# EAGLE design 328pv3 (EAGLE 7.6.0)
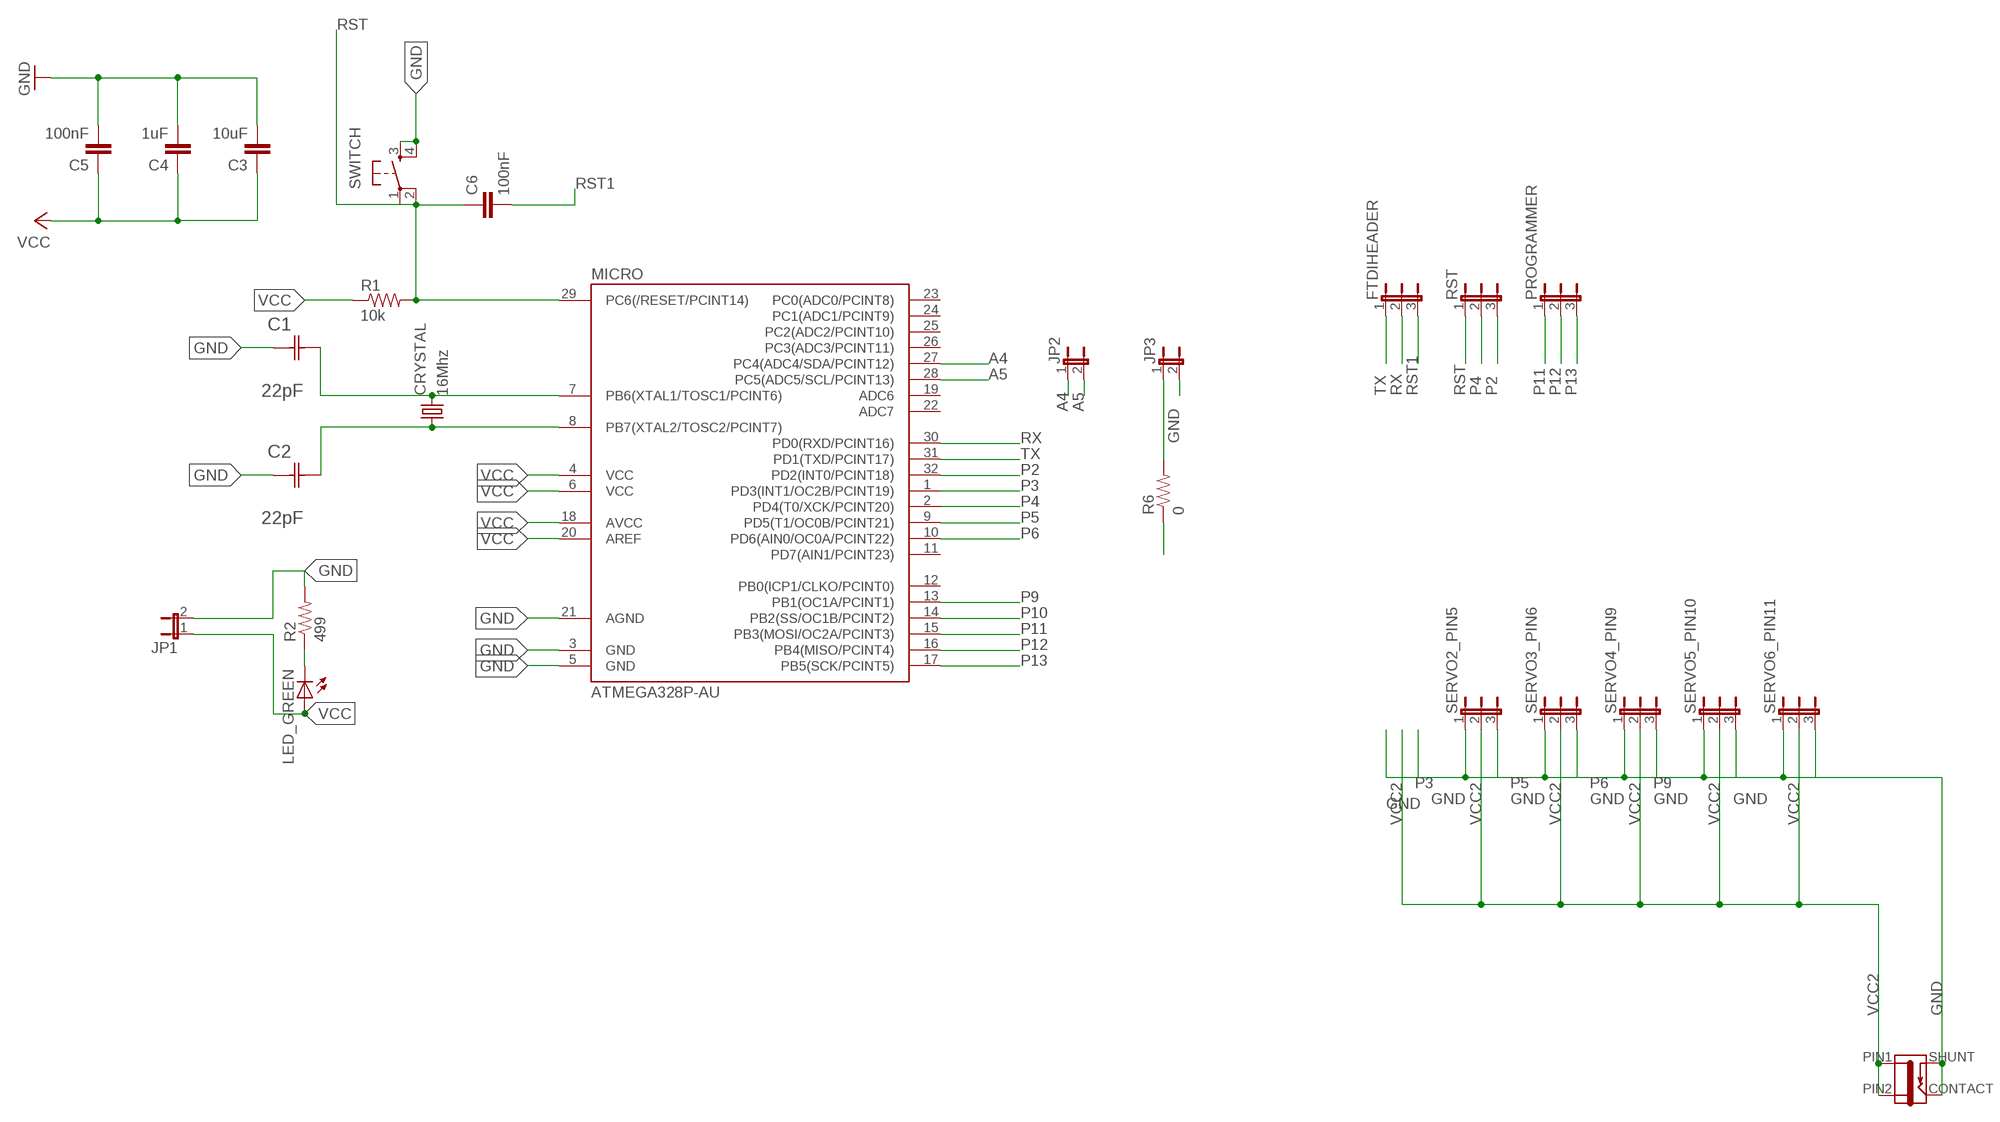
[diagram p0: schematic, sheet 1]

## Parts
C1  22pF  0612ZC225MAT2A  [CAPC3216X178N]
C2  22pF  0612ZC225MAT2A  [CAPC3216X178N]
C3  10uF  CAP1206  [1206]
C4  1uF  CAP1206  [1206]
C5  100nF  CAP1206  [1206]
C6  100nF  CAP1206  [1206]
CRYSTAL  16Mhz  CSM-7X-DU  [CSM-7X-DU]
FTDIHEADER  JP2E  [JP2]
J1  JACK-2.1MM  [PJ-002AH-SMT]
JP1  JP1E  [JP1]
JP2  JP1E  [JP1]
JP3  JP1E  [JP1]
LED_GREEN  LED1206  [1206]
MICRO  ATMEGA328P-AU  ATMEGA48/88/168-AU  [TQFP32-08]
PROGRAMMER  JP2E  [JP2]
R1  10k  RESISTOR1206  [1206]
R2  499  RESISTOR1206  [1206]
R6  0  RESISTOR1206  [1206]
RST  JP2E  [JP2]
SERVO2_PIN5  JP2E  [JP2]
SERVO3_PIN6  JP2E  [JP2]
SERVO4_PIN9  JP2E  [JP2]
SERVO5_PIN10  JP2E  [JP2]
SERVO6_PIN11  JP2E  [JP2]
SWITCH  6MM_SWITCH6MM_SWITCH  [6MM_SWITCH]

## Nets
A4: JP2.1 MICRO.27(PC4(ADC4/SDA/PCINT12))
A5: JP2.2 MICRO.28(PC5(ADC5/SCL/PCINT13))
GND: C1.1(C1) C2.1(C1) C3.2 C4.2 C5.2 J1.CONTACT J1.SHUNT JP1.2 JP3.2 MICRO.3(GND) MICRO.5(GND) MICRO.21(AGND) R2.2 SERVO2_PIN5.1 SERVO3_PIN6.1 SERVO4_PIN9.1 SERVO5_PIN10.1 SERVO6_PIN11.1 SWITCH.3(S) SWITCH.4(S1)
N$2: C1.2(C2) CRYSTAL.2 MICRO.7(PB6(XTAL1/TOSC1/PCINT6))
N$8: JP3.1 R6.2
N$9: C2.2(C2) CRYSTAL.1 MICRO.8(PB7(XTAL2/TOSC2/PCINT7))
N$26: LED_GREEN.2(C) R2.1
P2: MICRO.32(PD2(INT0/PCINT18)) RST.3
P3: MICRO.1(PD3(INT1/OC2B/PCINT19))
P4: MICRO.2(PD4(T0/XCK/PCINT20)) RST.2
P5: MICRO.9(PD5(T1/OC0B/PCINT21)) SERVO2_PIN5.3
P6: MICRO.10(PD6(AIN0/OC0A/PCINT22)) SERVO3_PIN6.3
P9: MICRO.13(PB1(OC1A/PCINT1)) SERVO4_PIN9.3
P10: MICRO.14(PB2(SS/OC1B/PCINT2)) SERVO5_PIN10.3
P11: MICRO.15(PB3(MOSI/OC2A/PCINT3)) PROGRAMMER.1 SERVO6_PIN11.3
P12: MICRO.16(PB4(MISO/PCINT4)) PROGRAMMER.2
P13: MICRO.17(PB5(SCK/PCINT5)) PROGRAMMER.3
RST: C6.1 MICRO.29(PC6(/RESET/PCINT14)) R1.2 RST.1 SWITCH.1(P) SWITCH.2(P1)
RST1: C6.2 FTDIHEADER.3
RX: FTDIHEADER.2 MICRO.30(PD0(RXD/PCINT16))
TX: FTDIHEADER.1 MICRO.31(PD1(TXD/PCINT17))
VCC: C3.1 C4.1 C5.1 JP1.1 LED_GREEN.1(A) MICRO.4(VCC) MICRO.6(VCC) MICRO.18(AVCC) MICRO.20(AREF) R1.1
VCC2: J1.PIN1 J1.PIN2 R6.1 SERVO2_PIN5.2 SERVO3_PIN6.2 SERVO4_PIN9.2 SERVO5_PIN10.2 SERVO6_PIN11.2
Unconnected: MICRO.11(PD7(AIN1/PCINT23)) MICRO.12(PB0(ICP1/CLKO/PCINT0)) MICRO.19(ADC6) MICRO.22(ADC7) MICRO.23(PC0(ADC0/PCINT8)) MICRO.24(PC1(ADC1/PCINT9)) MICRO.25(PC2(ADC2/PCINT10)) MICRO.26(PC3(ADC3/PCINT11))

## Library data of the parts
C1 C2 = AVX_By_element14_Batch_1:0612ZC225MAT2A: Capacitor 1206; MPN: 0612ZC225MAT2A; OC_FARNELL: -; OC_NEWARK: 12N3209; SUPPLIER: AVX; TOLERANCE: ±20%; VALUE: 2.2µF; VOLTAGERATING: 10V
C3-C6 = 01_SparkFun:CAP: Capacitor Standard 0603 ceramic capacitor, and 0.1" leaded capacitor.
CRYSTAL = 01_FAB_Hello:CSM-7X-DU: SMD CRYSTAL Source: www.ecsxtal.com .. Crystal 3.6864MHz CSM_7X_DU.PDF; OC_FARNELL: unknown; OC_NEWARK: unknown
FTDIHEADER PROGRAMMER RST SERVO2_PIN5 SERVO3_PIN6 SERVO4_PIN9 SERVO5_PIN10 SERVO6_PIN11 = jumper:JP2E: JUMPER
J1 = fab:JACK-2.1MM: SMD DC power jack PJ-002AH-SMT As found in the fablab inventory. Made by Zaerc.
JP1-JP3 = jumper:JP1E: JUMPER
LED_GREEN = 01_FAB_Hello:LED
MICRO = atmega8:ATMEGA48/88/168
R1 R2 R6 = 01_SparkFun:RESISTOR: Resistor Basic schematic elements and footprints for 0603, 1206, and PTH 1/10th watt (small) resistors.
SWITCH = 01_FAB_Hello:6MM_SWITCH: OMRON SWITCH

## Board
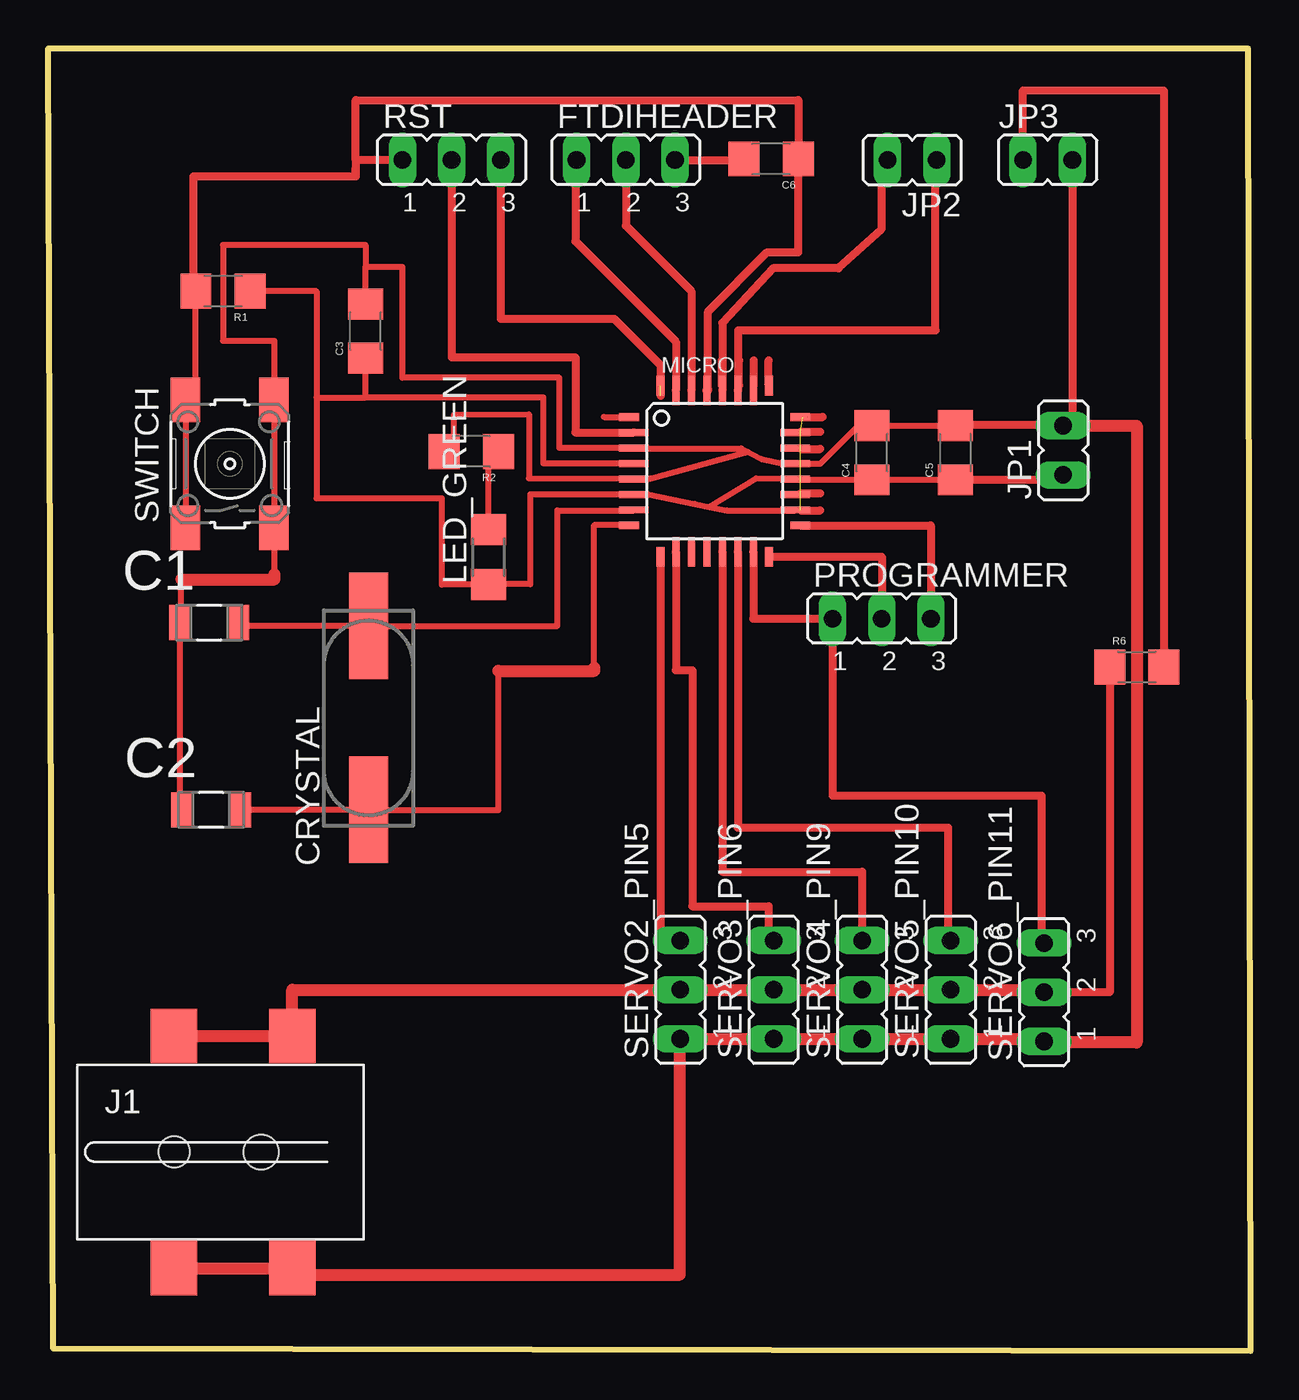
[diagram p1: board, top side]

Size 62.11 x 67.31 mm. Coordinates in mm from the lower left corner, seen from the top.
Outline: 0,67.31 61.98,67.31 62.11,0 0.25,0.13 0,67.31
Copper layers (1*16): Top 0.035mm / dielectric 1.5mm / Bottom 0.035mm
Design rules "fab": minimum track width 0.3mm, minimum drill 32mil, track to track 0.315mm, track to pad 0.315mm, pad to pad 0.315mm, via to via 0.315mm, smd to smd 0.315mm, copper to edge 40mil, drill to drill 16mil, minimum pad ring 10mil, minimum via ring 8mil, stop-mask expansion 4mil, vias tented up to drill 0mil, thermal gap 10mil

### Footprints (pad centres in the part's own frame; a part is rotated, then mirrored left to right if it is on the bottom)
CAPC3216X178N = smd 1.118 x 1.803: 1 -1.499,0; 2 1.499,0
1206 = smd 1.6 x 1.8: 1 -1.4,0; 2 1.4,0
CSM-7X-DU = smd 5.5 x 2: 1 -4.75,0; 2 4.75,0
JP2 = drill 0.914 long: 1 -2.54,0; 2 0,0; 3 2.54,0
PJ-002AH-SMT = smd 2.4 x 2.8: CONTACT -2.4,-6; PIN1 3.7,6; PIN2 -2.4,6; SHUNT 3.7,-6 | hole 1.6: -2.4,0 | hole 1.8: 2.1,0
JP1 = drill 0.914 long: 1 0,-1.27; 2 0,1.27
1206' = smd 1.6 x 1.803: 1 -1.422,0; 2 1.422,0
TQFP32-08 = smd 1.016 x 0.406: 1 -4.42,2.8; 8 -4.42,-2.8; 17 4.42,-2.8; 24 4.42,2.8 | smd 1.524 x 0.356: 2 -4.166,2; 3 -4.166,1.2; 4 -4.166,0.4; 5 -4.166,-0.4; 6 -4.166,-1.2; 7 -4.166,-2; 18 4.166,-2; 19 4.166,-1.2; 20 4.166,-0.4; 21 4.166,0.4; 22 4.166,1.2; 23 4.166,2 | smd 0.406 x 1.016: 9 -2.8,-4.42; 16 2.8,-4.42; 25 2.8,4.42; 32 -2.8,4.42 | smd 0.356 x 1.524: 10 -2,-4.166; 11 -1.2,-4.166; 12 -0.4,-4.166; 13 0.4,-4.166; 14 1.2,-4.166; 15 2,-4.166; 26 2,4.166; 27 1.2,4.166; 28 0.4,4.166; 29 -0.4,4.166; 30 -1.2,4.166; 31 -2,4.166
6MM_SWITCH = smd 2.286 x 1.524: 1 -3.302,2.286; 2 3.302,2.286; 3 -3.302,-2.286; 4 3.302,-2.286

### Placement (x,y rotation side)
C1  8.31,37.64 0 top
C2  8.41,27.97 0 top
C3  16.39,52.7 90 top
C4  42.55,46.42 90 top
C5  46.87,46.42 90 top
C6  37.34,61.59 180 top
CRYSTAL  16.54,32.72 90 top
FTDIHEADER  29.83,61.55 0 top
J1  8.9,10.29 0 top
JP1  52.43,46.55 0 top
JP2  44.63,61.55 90 top
JP3  51.63,61.55 270 top
LED_GREEN  [1206']  22.74,41.02 90 top
MICRO  34.42,45.47 0 top
PROGRAMMER  43.06,37.85 0 top
R1  9.02,54.76 180 top
R2  21.85,46.48 180 top
R6  56.23,35.35 0 top
RST  20.83,61.55 0 top
SERVO2_PIN5  32.65,18.67 90 top
SERVO3_PIN6  37.47,18.67 90 top
SERVO4_PIN9  42.04,18.67 90 top
SERVO5_PIN10  46.62,18.67 90 top
SERVO6_PIN11  51.44,18.54 90 top
SWITCH  9.38,45.85 90 top

### Tracks (layer width: path | path; a pad name or v marks a point on that pad's centre or on a via)
A4
  Top 0.406: MICRO.27 35.63,52.75 45.83,52.75 45.83,61.55 JP2.1
A5
  Top 0.406: JP2.2 43.03,61.22 43.03,57.95 40.83,55.95 37.43,55.95 34.82,53.14 MICRO.28
GND
  Top 0.305: MICRO.5 | MICRO.21 | C2.1 6.81,27.96 C1.1 | C1.1 6.74,37.64 | MICRO.5 30.26,45.09 24.83,45.11 24.83,48.41 20.96,48.39 20.96,46.36 R2.2 20.96,46.61 | C1.1 6.86,37.64 6.86,39.88 | MICRO.5 30.87,45.09 31.12,45.09 36,46.43 | MICRO.21 37.98,45.85 36.84,46.1 35.81,46.64 | 16.39,56.01 18.29,56.01 18.29,50.29 26.4,50.29 26.4,46.67 MICRO.3 30.28,46.64 35.81,46.64 | 36,46.43 36.13,46.47 | 35.81,46.64 36,46.43 | C3.2 16.39,56.01 | SWITCH.3 11.69,42.55 | 11.69,40.15 11.69,42.55 | 11.69,42.55 11.69,48.51 11.66,48.51 SWITCH.4 11.69,49.15 11.69,52.2 9.02,52.2 9.02,57.15 16.39,57.15 16.39,56.01 | MICRO.21 38.61,45.85 39.88,45.85 41.85,47.82 C4.2 C5.2 | C5.2 46.87,48.01 | 47.38,47.82 C5.2
  Top 0.406: 47.38,47.82 47.38,47.88 52.43,47.88 JP1.2 52.9,47.82 JP3.2 | 42.55,47.51 C4.2
  Top 0.61: C5.2 46.93,47.82 | 6.86,39.88 11.69,39.88 11.69,40.15 | JP1.2 56.23,47.82 56.23,15.95 51.44,15.95 SERVO6_PIN11.1 51.44,16.13 SERVO5_PIN10.1 SERVO4_PIN9.1 SERVO3_PIN6.1 SERVO2_PIN5.1 32.63,3.95 12.6,3.95 J1.SHUNT J1.CONTACT
N$2
  Top 0.305: 9.81,37.47 C1.2 9.81,37.47 | MICRO.7 30.26,43.43 26.3,43.43 26.3,37.47 CRYSTAL.2 9.81,37.47
N$3
  Top 0.406: 34.8,49.91 34.8,51.18
N$6
  Top 0.406: 35.69,49.91 35.69,51.18
N$8
  Top 0.406: JP3.1 50.36,65.15 57.63,65.15 R6.2
N$9
  Top 0.305: 9.91,27.94 C2.2 | MICRO.8 28.2,42.67 28.2,35.31 | C2.2 CRYSTAL.1 16.54,27.94 23.25,27.94 23.25,35.15 23.25,35.31 | C2.2
  Top 0.61: 23.25,35.15 28.2,35.15 28.2,35.31
N$11
  Top 0.406: 37.22,49.91 37.22,51.18
N$12
  Top 0.406: 36.45,49.91 36.45,51.18
N$13  (5 unrouted)
  Top 0.406: 38.99,48.26 40.01,48.26 | 38.87,47.5 39.88,47.5 | 38.87,46.61 39.88,46.61 | 38.87,44.32 39.88,44.32 | 38.87,43.43 39.88,43.43
N$26
  Top 0.305: 23.63,46.23 R2.1 23.25,46.1 22.74,46.1 LED_GREEN.2
P2  (1 unrouted)
  Top 0.305: MICRO.32
  Top 0.406: RST.3 23.37,53.35 29.23,53.35 31.63,50.95 31.63,49.35
P3
  Top 0.305: 28.71,48.26 MICRO.1
P4
  Top 0.406: RST.2 20.83,51.35 27.23,51.35 27.23,47.47 MICRO.2
P5
  Top 0.305: SERVO2_PIN5.3 32.14,21.72 31.88,21.72
  Top 0.406: 31.88,21.72 31.62,21.72 MICRO.9
P6
  Top 0.406: 36.96,21.21 SERVO3_PIN6.3 37.22,21.21 37.22,22.99 33.28,22.99 33.28,35.18 32.42,35.18 MICRO.10
P9
  Top 0.406: MICRO.13 34.82,24.77 42.04,24.77 SERVO4_PIN9.3
P10
  Top 0.406: MICRO.14 35.62,27.05 46.49,27.05 46.49,21.21 SERVO5_PIN10.3
P11
  Top 0.406: MICRO.15 36.42,37.85 PROGRAMMER.1 40.52,28.7 51.31,28.7 51.31,21.08 SERVO6_PIN11.3
P12
  Top 0.305: MICRO.16
  Top 0.406: MICRO.16 43.06,41.05 PROGRAMMER.2
P13
  Top 0.406: MICRO.17 45.6,42.67 PROGRAMMER.3
RST
  Top 0.305: 34.04,49.63 MICRO.29 | 7.37,54.76 R1.2 | R1.2 7.62,49.15 SWITCH.2 SWITCH.1 | R1.2 7.37,55.01 | C6.1 38.87,61.59
  Top 0.406: MICRO.29 34.04,49.65 | 38.74,56.77 C6.1 38.74,64.64 15.88,64.64 15.88,61.55 | R1.2 7.5,54.76 7.5,60.71 15.88,60.71 | 15.88,61.15 15.88,60.71 | 15.88,61.55 15.88,61.15 | 15.88,60.71 15.88,61.15 | RST.1 15.88,61.55
  Top 0.42: MICRO.29 34.08,49.69 34.08,53.72 37.13,56.77 38.74,56.77
  Top 0.5: MICRO.29 34.05,49.66
RST1
  Top 0.406: FTDIHEADER.3 35.94,61.55 C6.2
RX
  Top 0.406: FTDIHEADER.2 29.83,58.15 33.22,54.76 MICRO.30
TX
  Top 0.406: FTDIHEADER.1 27.23,61.49 27.23,57.35 32.42,52.16 MICRO.31
VCC
  Top 0.305: MICRO.18 38.59,43.43 35.06,43.43 34.16,43.62 | MICRO.20 | MICRO.4 25.58,45.87 25.58,49.28 16.39,49.28 | 13.85,49.28 13.85,54.76 R1.1 | 13.85,49.28 13.85,44.07 20.33,44.07 20.33,39.6 LED_GREEN.1 22.74,39.62 24.9,39.62 24.9,44.27 MICRO.6 30.94,44.27 33.4,43.77 34.16,43.62 | 34.16,43.62 36.58,45.09 MICRO.20 | 13.85,49.28 16.39,49.28 | 16.39,49.28 C3.1 16.77,51.3 16.77,51.05 | MICRO.20 38.64,45.02 C4.1 C5.1
  Top 0.406: C5.1 52.43,45.02 JP1.1
VCC2
  Top 0.406: 6.5,16.26 J1.PIN2 | 12.63,16.26 J1.PIN1 | R6.1 54.83,18.54 SERVO6_PIN11.2
  Top 0.61: SERVO6_PIN11.2 51.44,18.67 SERVO5_PIN10.2 SERVO4_PIN9.2 SERVO3_PIN6.2 SERVO2_PIN5.2 12.6,18.67 J1.PIN1 J1.PIN2